# Altium schematic sheet CAN.SchDoc: MCP2515 CAN BUS
size 420 x 297 mm
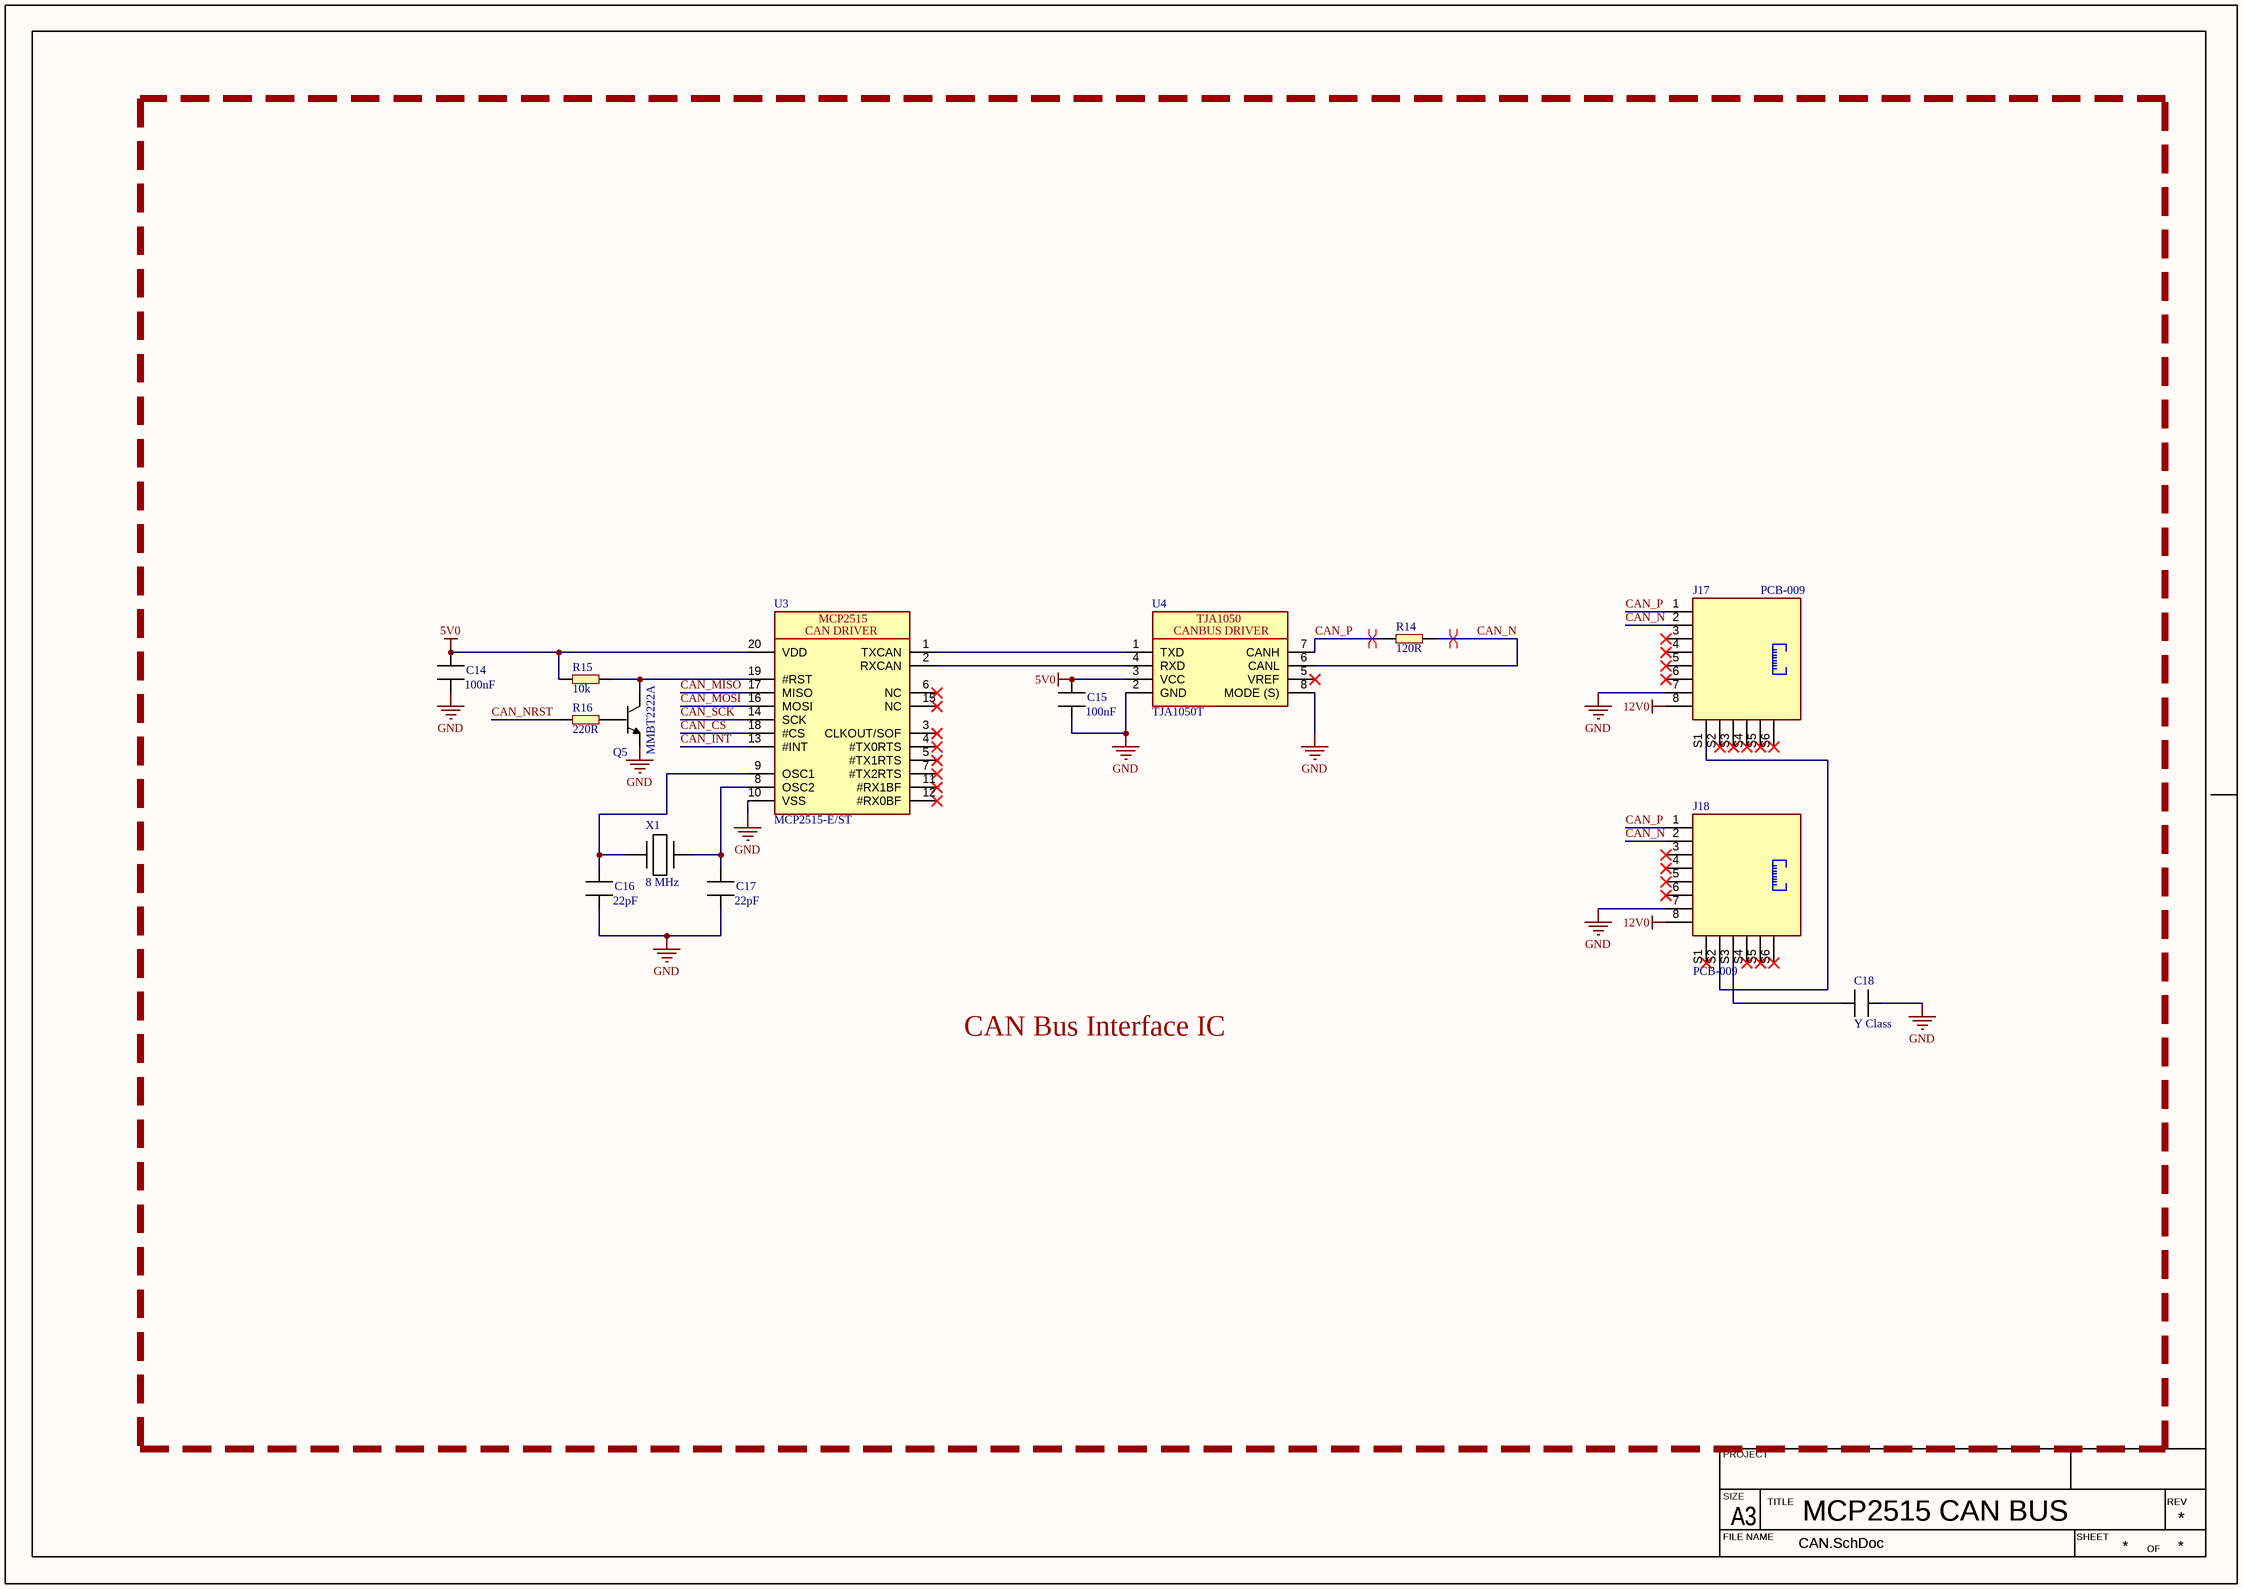
[diagram p0: CAN.SchDoc]

## Parts
C14  value 100nF  [CAPC2012X13L]  (hidden comment: MLCC_0805)
C15  value 100nF  [CAPC2012X13L]  (hidden comment: MLCC_0805)
C16  value 22pF  [CAPC2012X13L]  (hidden comment: MLCC_0805)
C17  value 22pF  [CAPC2012X13L]  (hidden comment: MLCC_0805)
C18  value Y Class  [VY1222M43Y5UC63V0]  (hidden comment: VY1)
J17  value PCB-009  [PCB-009]  (hidden comment: ERP_148-3)
J18  value PCB-009  [PCB-009]  (hidden comment: ERP_148-3)
Q5  value MMBT2222A  [MMBT2222]  (hidden comment: ERP_105-1)
R14  value 120R  [RES_0603]  (hidden comment: ERP_101-1)
R15  value 10k  [RES_0603]  (hidden comment: ERP_101-1)
R16  value 220R  [RES_0603]  (hidden comment: ERP_101-1)
U3  value MCP2515-E/ST  [MCP2515-ST]  (hidden comment: MCP2515)
U4  value TJA1050T  [TJA1050T]  (hidden comment: TJA1050)
X1  value 8 MHz  [HC-49US]  (hidden comment: HC-49US)

## Blocks framed on the sheet
CAN Bus Interface IC: C14-C18 J17 J18 Q5 R14-R16 U3 U4 X1

## Nets
5V0: C14.1 C15.1 R15.1 U3.20(VDD) U4.3(VCC)
12V0: J17.8 J18.8
GND: C14.2 C15.2 C16.2 C17.2 C18.2 J17.7 J18.7 Q5.2 U3.10(VSS) U4.2(GND) U4.8(MODE_(S))
CAN_CS: U3.18(#CS)
CAN_INT: U3.13(#INT)
CAN_MISO: U3.17(MISO)
CAN_MOSI: U3.16(MOSI)
CAN_N: J17.2 J18.2 R14.2 U4.6(CANL)
CAN_NRST: R16.1
CAN_P: J17.1 J18.1 R14.1 U4.7(CANH)
CAN_SCK: U3.14(SCK)
NetC16_1: C16.1 U3.9(OSC1) X1.1
NetC17_1: C17.1 U3.8(OSC2) X1.2
NetC18_1: C18.1 J18.S3
NetJ17_S1: J17.S1 J18.S2
NetQ5_1: Q5.1 R16.2
NetQ5_3: Q5.3 R15.2 U3.19(#RST)
NetU3_1: U3.1(TXCAN) U4.1(TXD)
NetU3_2: U3.2(RXCAN) U4.4(RXD)

Not connected (* = marked no-connect by the designer): J17 3* 4* 5* 6* S2* S3* S4* S5* S6*; J18 3* 4* 5* 6* S1* S4* S5* S6*; U3 3(CLKOUT/SOF)* 4(#TX0RTS)* 5(#TX1RTS)* 6(NC)* 7(#TX2RTS)* 11(#RX1BF)* 12(#RX0BF)* 15(NC)*; U4 5(VREF)*

## Layout directives
differential pair; differential pair class CAN_120R; rule Differential Pairs Routing [Pref Gap = 10mil    Min Gap  = 10mil    Max Gap  = 10milPref Width = 16.535mil    Min Width  = 16.535mil    Max Width  = 16.535mil]: CAN_N, CAN_P

## Notes on the sheet
- PROJECT
- SIZE
- FILE NAME
- A3
- TITLE
- SHEET
- OF
- REV
- (in symbol MCP2515) CAN DRIVER
- (in symbol TJA1050) CANBUS DRIVER

## Library data of the parts
C14-C17 = MLCC_0805: Chip Capacitor, 2-Leads, Body 2.00x1.25mm, IPC High Density; Package: 0805; Manufacturer 1: *; Manufacturer Part Number 1: *
C18 = VY1: Ceramic Capacitor Y5U (E) Radial, Disc; Manufacturer 1: *; Manufacturer Part Number 1: *
J17 J18 = RJ45_Top_Entry: PCB-009 Robu; Manufacturer Part Number 1: *; Manufacturer 1: *; Supplier Part Number 1: *; Supplier 1: *; ERP: *; Package: 8P8C
Q5 = MMBT2222: MMBT2222A; ERP: *; Suuplier Part Number 1: *; Supplier 1: *; Manufacturer Part Number 1: *; Manufacturer 1: *; Package: SOT23
R14 = RES_0603: Manufacturer Part Number 1: 560112116003; Package: 0603; Manufacturer 1: *
R15 R16 = RES_0603: Package: 0603; Manufacturer 1: *; Manufacturer Part Number 1: *
U3 = MCP2515: CAN Interface IC; Manufacturer 1: *; Manufacturer Part Number 1: *
U4 = TJA1050: CAN Transceiver IC; Manufacturer 1: *; Manufacturer Part Number 1: *
X1 = HC-49US: CRYSTAL HC-49US 2 Pin; Package: HC-49US; ERP: *; Manufacturer Part Number 1: *; Manufacturer 1: *